# EAGLE design Slaves-Power-board (EAGLE 9.5.2)
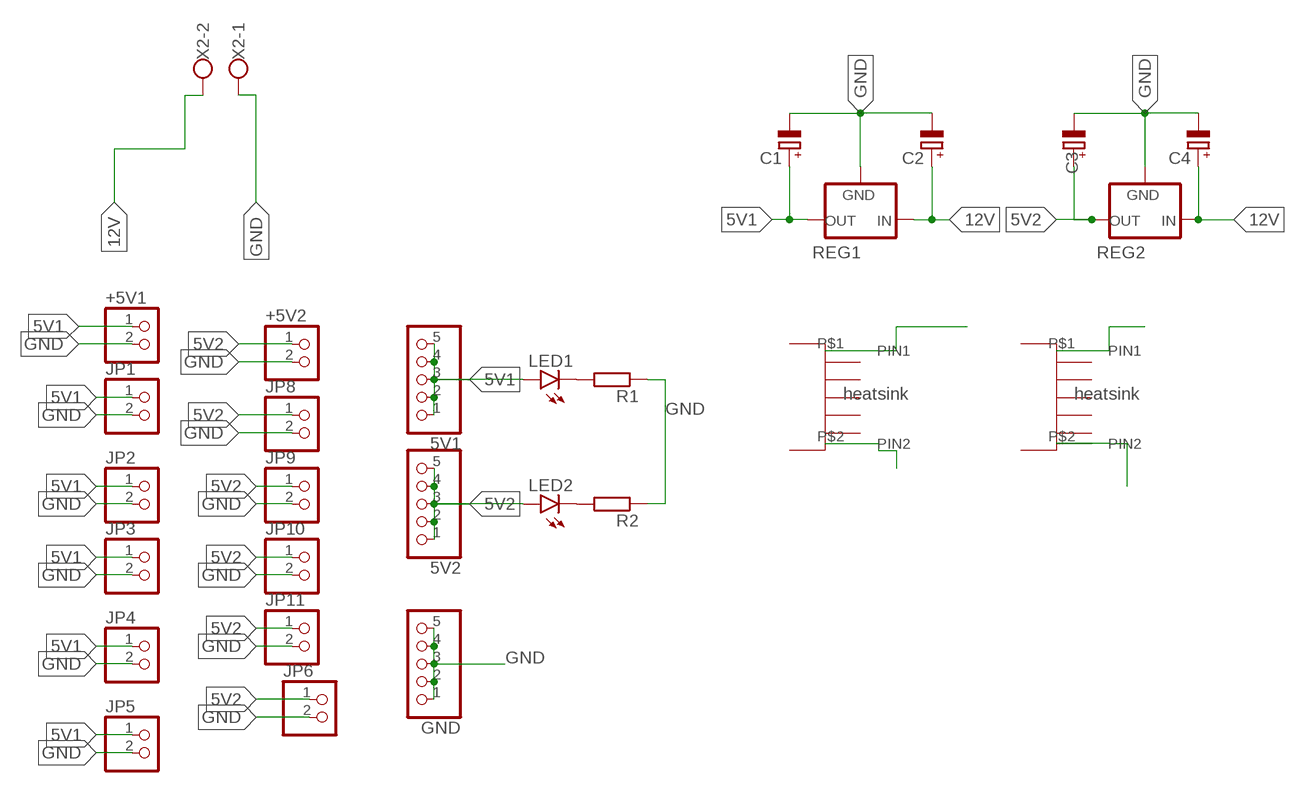
[diagram p0: schematic, sheet 1]

## Parts
5V1  PINHD-1X5  [1X05]
5V2  PINHD-1X5  [1X05]
+5V1  PINHD-2_DATA  [1X02_DATA]
+5V2  PINHD-2_DATA  [1X02_DATA]
C1  CAP_POL  [E3,5-8]
C2  CAP_POL  [E3,5-8]
C3  CAP_POL  [E3,5-8]
C4  CAP_POL  [E3,5-8]
GND  PINHD-1X5  [1X05]
JP1  PINHD-2_DATA  [1X02_DATA]
JP2  PINHD-2_DATA  [1X02_DATA]
JP3  PINHD-2_DATA  [1X02_DATA]
JP4  PINHD-2_DATA  [1X02_DATA]
JP5  PINHD-2_DATA  [1X02_DATA]
JP6  PINHD-2_DATA  [1X02_DATA]
JP8  PINHD-2_DATA  [1X02_DATA]
JP9  PINHD-2_DATA  [1X02_DATA]
JP10  PINHD-2_DATA  [1X02_DATA]
JP11  PINHD-2_DATA  [1X02_DATA]
LED1  LED5MM  [LED5MM]
LED2  LED5MM  [LED5MM]
R1  R-EU_0204/7  [0204/7]
R2  R-EU_0204/7  [0204/7]
REG1  78XXS  [78XXS]
REG2  78XXS  [78XXS]
U$1  HEAT-SINK  [HEAT_SINK]
U$2  HEAT-SINK  [HEAT_SINK]
X2  ROSTA.POWER  [W239-302]

## Nets
5V1: 5V1.1 5V1.2 5V1.3 5V1.4 5V1.5 +5V1.1 C1.+ JP1.1 JP2.1 JP3.1 JP4.1 JP5.1 LED1.A REG1.OUT
5V2: 5V2.1 5V2.2 5V2.3 5V2.4 5V2.5 +5V2.1 C3.+ JP6.1 JP8.1 JP9.1 JP10.1 JP11.1 LED2.A REG2.OUT
12V: C2.+ C4.+ REG1.IN REG2.IN X2.2
GND: +5V1.2 +5V2.2 C1.- C2.- C3.- C4.- GND.1 GND.2 GND.3 GND.4 GND.5 JP1.2 JP2.2 JP3.2 JP4.2 JP5.2 JP6.2 JP8.2 JP9.2 JP10.2 JP11.2 R1.1 R2.1 REG1.GND REG2.GND X2.1
N$1: LED1.K(C) R1.2
N$2: LED2.K(C) R2.2
N$3: U$1.P$2(PIN2)
N$4: U$1.P$1(PIN1)
N$5: U$2.P$1(PIN1)
N$6: U$2.P$2(PIN2)

## Library data of the parts
5V1 5V2 GND = MIA_LIBRARY-2-2-2:PINHD-1X5: PIN HEADER
+5V1 +5V2 JP1-JP6 JP8-JP11 = MIA_LIBRARY-2-2-2:PINHD-2_DATA: PIN HEADER
C1-C4 = MIA_LIBRARY-2-2-2:CAP_POL
LED1 LED2 = led:LED: LED OSRAM: - CHIPLED LG R971, LG N971, LY N971, LG Q971, LY Q971, LO R971, LY R971 LH N974, LH R974 LS Q976, LO Q976, LY Q976 LO Q996 - Hyper CHIPLED LW Q18S LB Q993, LB Q99A, LB R99A - SideLED LS A670, LO A670, LY A670, LG A670, LP A670 LB A673, LV A673, LT A673, LW A673 LH A674 LY A675 LS A676, LA A676, LO A676, LY A676, LW A676 LS A679, LY A679, LG A679 - Hyper Micro SIDELED® LS Y876, LA Y876, LO Y876, LY Y876 LT Y87S - SmartLED LW L88C, LW L88S LB L89C, LB L89S, LG L890 LS L89K, LO L89K, LY L89K LS L896, LA L896, LO L896, LY L896 - TOPLED LS T670, LO T670, LY T670, LG T670, LP T670 LSG T670, LSP T670, LSY T670, LOP T670, LYG T670 LG T671, LOG T671, LSG T671 LB T673, LV T673, LT T673, LW T673 LH T674 LS T676, LA T676, LO T676, LY T676, LB T676, LH T676, LSB T676, LW T676 LB T67C, LV T67C, LT T67C, LS T67K, LO T67K, LY T67K, LW E67C LS E67B, LA E67B, LO E67B, LY E67B, LB E67C, LV E67C, LT E67C LW T67C LS T679, LY T679, LG T679 LS T770, LO T770, LY T770, LG T770, LP T770 LB T773, LV T773, LT T773, LW T773 LH T774 LS E675, LA E675, LY E675, LS T675 LS T776, LA T776, LO T776, LY T776, LB T776 LHGB T686 LT T68C, LB T68C - Hyper Mini TOPLED® LB M676 - Mini TOPLED Santana® LG M470 LS M47K, LO M47K, LY M47K Source: http://www.osram.convergy.de LUXEON: - LUMILED® LXK2-PW12-R00, LXK2-PW12-S00, LXK2-PW14-U00, LXK2-PW14-V00 LXK2-PM12-R00, LXK2-PM12-S00, LXK2-PM14-U00 LXK2-PE12-Q00, LXK2-PE12-R00, LXK2-PE12-S00, LXK2-PE14-T00, LXK2-PE14-U00 LXK2-PB12-K00, LXK2-PB12-L00, LXK2-PB12-M00, LXK2-PB14-N00, LXK2-PB14-P00, LXK2-PB14-Q00 LXK2-PR12-L00, LXK2-PR12-M00, LXK2-PR14-Q00, LXK2-PR14-R00 LXK2-PD12-Q00, LXK2-PD12-R00, LXK2-PD12-S00 LXK2-PH12-R00, LXK2-PH12-S00 LXK2-PL12-P00, LXK2-PL12-Q00, LXK2-PL12-R00 Source: www.luxeon.com KINGBRIGHT: KA-3528ASYC Source: www.kingbright.com
R1 R2 = rcl:R-EU_: RESISTOR, European symbol; SPICEPREFIX: R
REG1 REG2 = MIA_LIBRARY-2-2-2:78XXS: VOLTAGE REGULATOR
U$1 U$2 = MIA_LIBRARY-2-2-2:HEAT-SINK
X2 = MIA_LIBRARY-2-2-2:ROSTA.POWER: WAGO SCREW CLAMP; OC_FARNELL: unknown; OC_NEWARK: unknown

## Board
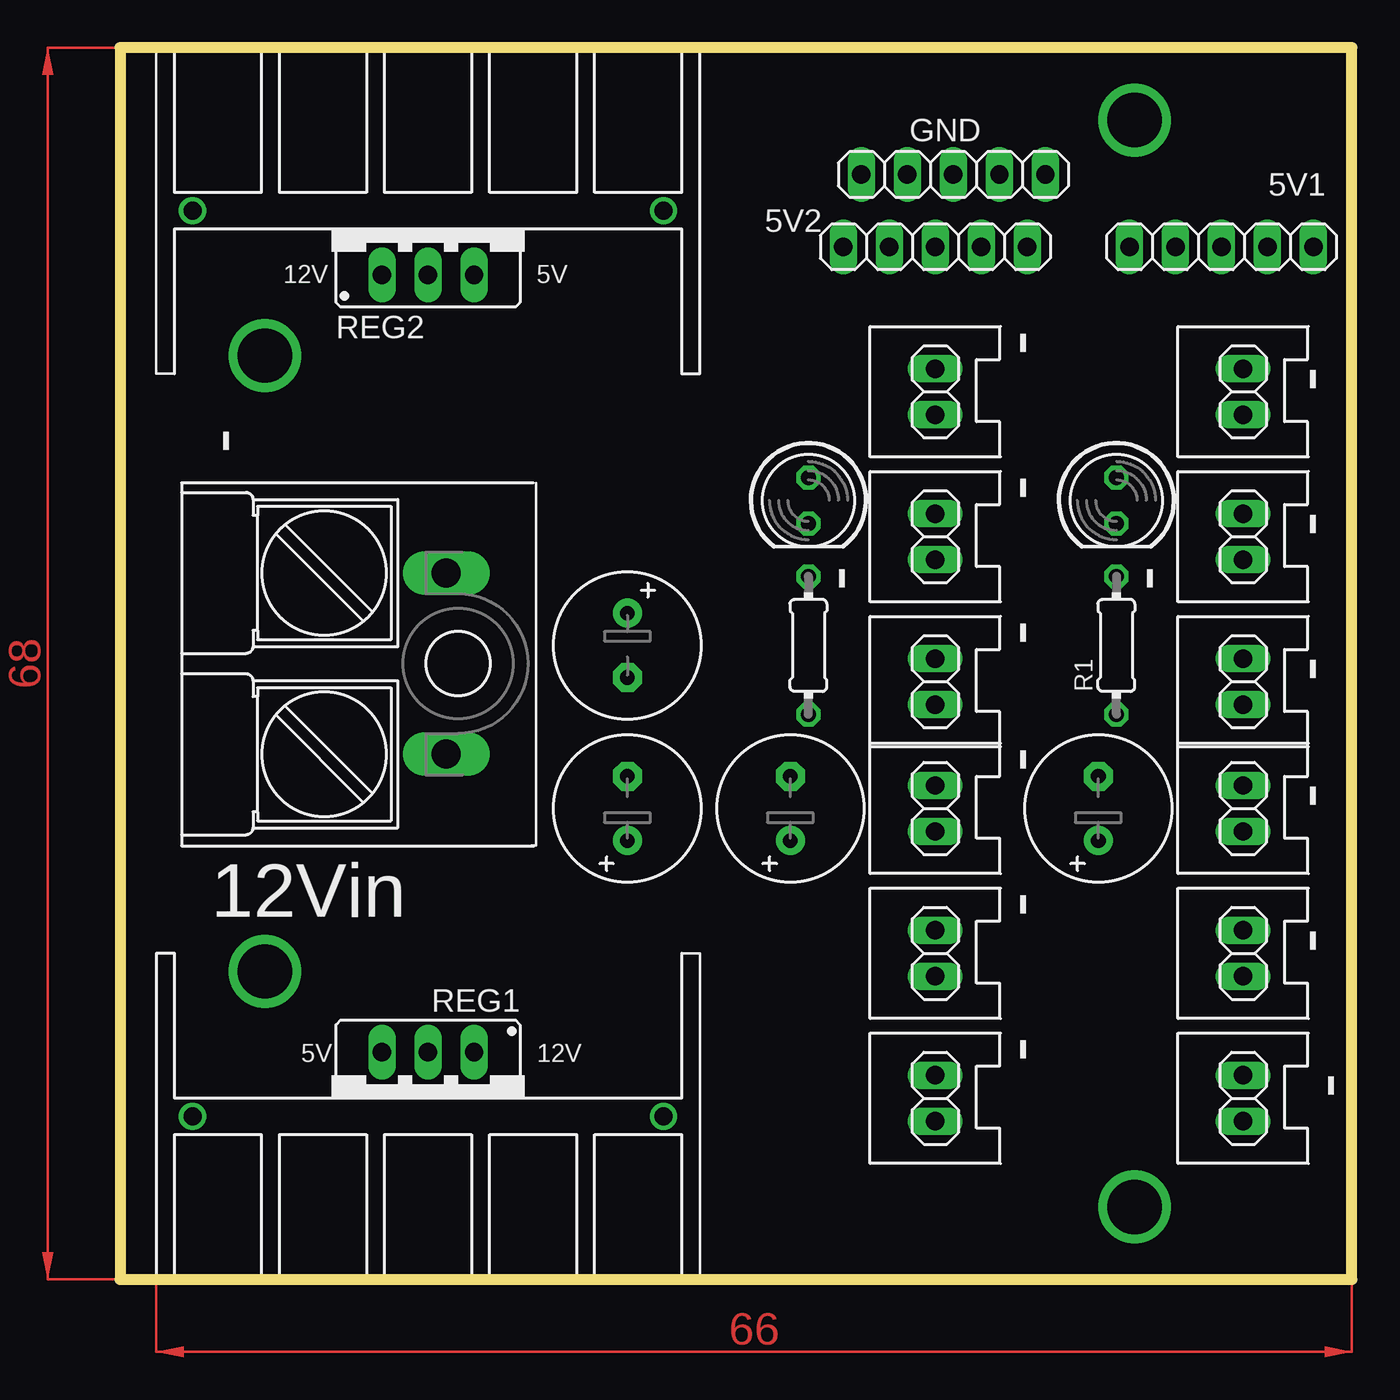
[diagram p1: board, top side]
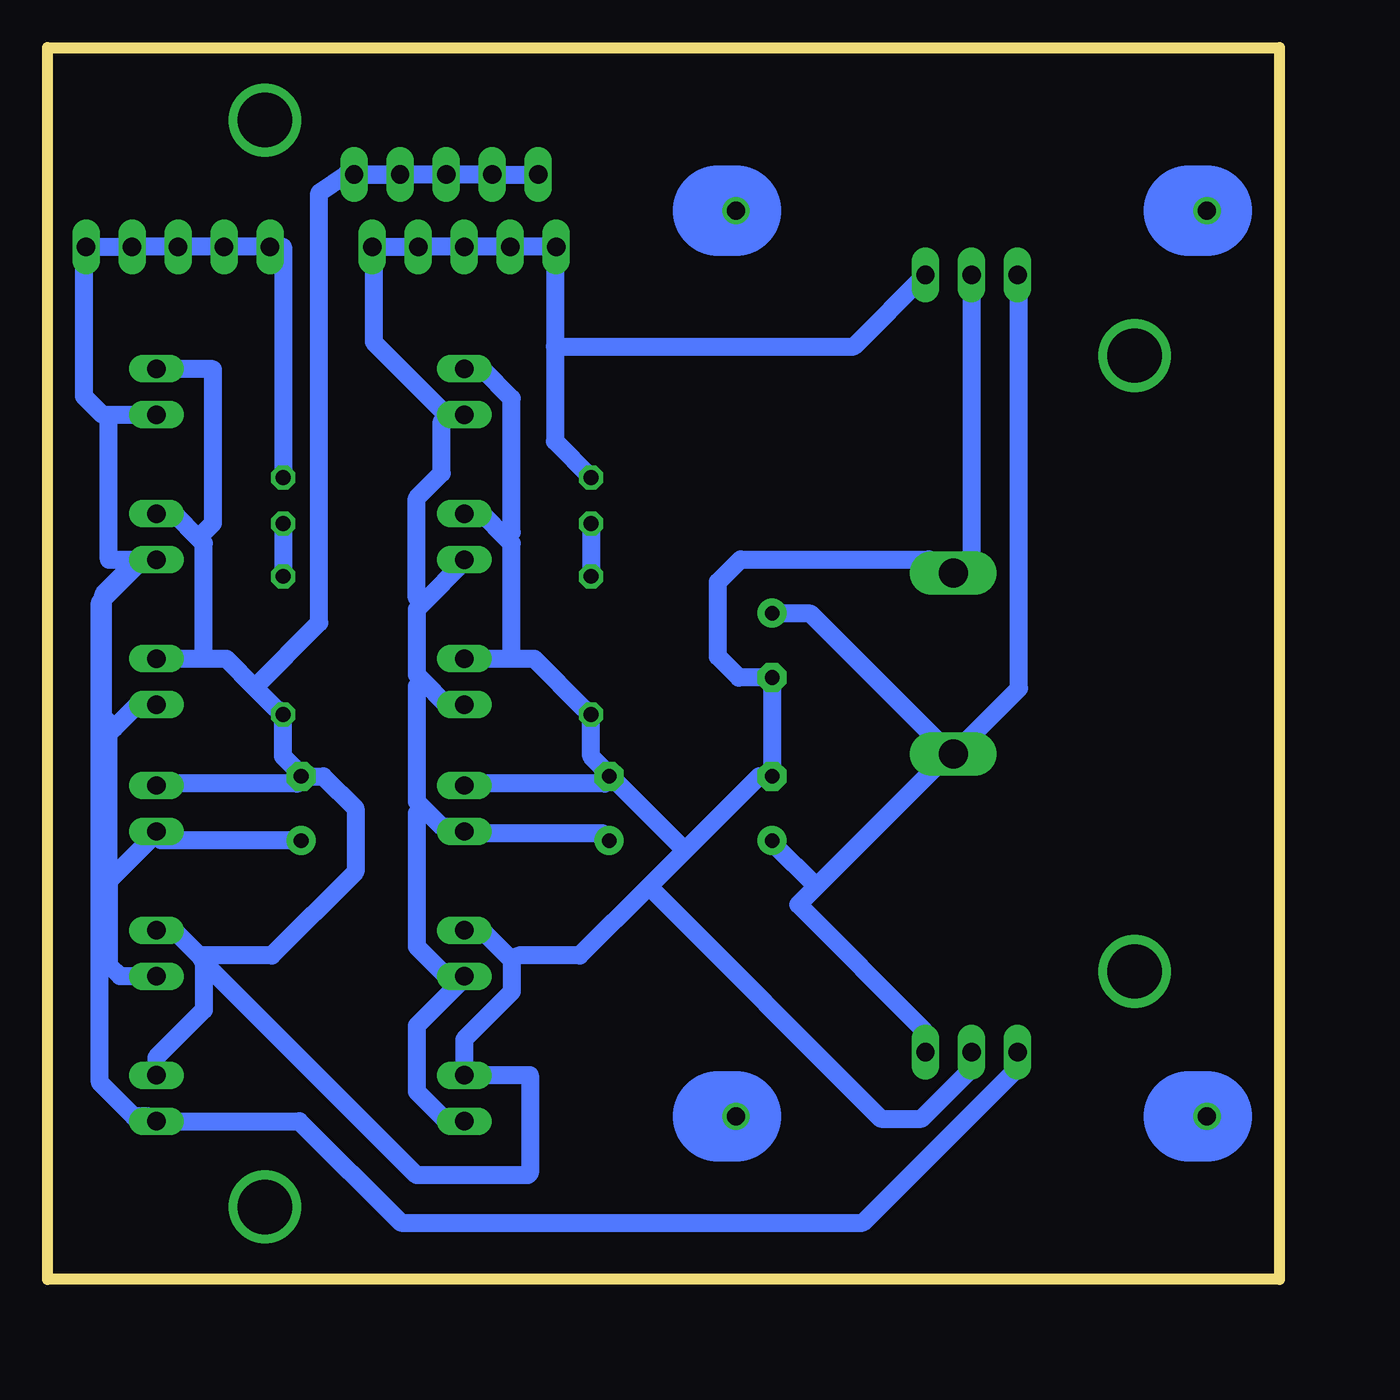
[diagram p2: board, bottom side, seen from below]

Size 68 x 68 mm. Coordinates in mm from the lower left corner, seen from the top.
Outline: 0,0 68,0 68,68 0,68 0,0
Copper layers (1*16): Top 0.035mm / dielectric 1.5mm / Bottom 0.035mm
Design rules "default *": minimum track width 1mm, minimum drill 1mm, track to track 0.6mm, track to pad 0.6mm, pad to pad 0.6mm, via to via 0.6mm, smd to smd 6mil, copper to edge 40mil, drill to drill 6mil, minimum pad ring 10mil, minimum via ring 8mil, stop-mask expansion 4mil, vias tented up to drill 0mil, thermal gap 10mil

### Footprints (pad centres in the part's own frame; a part is rotated, then mirrored left to right if it is on the bottom)
1X05 = drill 1.016 long: 1 -5.08,0; 2 -2.54,0; 3 0,0; 4 2.54,0; 5 5.08,0
1X02_DATA = drill 1.016 long: 1 -1.27,0; 2 1.27,0
E3,5-8 = drill 0.813 pad 1.6: + -1.778,0 | drill 0.813 pad 1.6 octagon: - 1.778,0
LED5MM = drill 0.813 octagon: A -1.27,0; K 1.27,0
0204/7 = drill 0.813 octagon: 1 -3.81,0; 2 3.81,0
78XXS = drill 1.016 long: GND 0,-2.54; IN -2.54,-2.54; OUT 2.54,-2.54
HEAT_SINK = drill 1: P$1 0,13; P$2 0,-13
W239-302 = drill 1.6 long: 1 -5,5; 2 5,5

### Placement (x,y rotation side)
5V1  60.8,57 0 top
5V2  45,57 0 top
+5V1  62,49 90 top
+5V2  45,49 90 top
C1  54,26 90 top
C2  28,26 90 top
C3  37,26 90 top
C4  28,35 270 top
GND  46,61 0 top
JP1  62,33 90 top
JP2  62,26 90 top
JP3  62,18 90 top
JP4  62,10 90 top
JP5  62,41 90 top
JP6  45,10 90 top
JP8  45,41 90 top
JP9  45,33 90 top
JP10  45,26 90 top
JP11  45,18 90 top
LED1  55,43 270 top
LED2  38,43 270 top
R1  55,35 90 top
R2  38,35 90 top
REG1  17,10 180 top
REG2  17,58 0 top
U$1  17,59 90 top
U$2  17,9 270 top
X2  13,34 270 top

### Tracks (layer width: path | path; a pad name or v marks a point on that pad's centre or on a via)
5V1
  Bottom 1: LED1.A 55,57 5V1.1 5V1.2 5V1.3 5V1.4 5V1.5 66,56.88 66,48.75 65,47.75 62,47.75 +5V1.1 64.47,47.73 64.62,47.68 64.62,39.73 JP5.1 63.02,39.73 64.92,37.83 64.92,31.05 64.31,30.44 | 64.31,22.31 62,24.62 JP2.1 61.75,24.25 54,24.25 C1.+ | 64.31,22.31 64.62,22 64.62,17.38 64,16.75 62,16.75 JP3.1 | 64.31,30.44 64.62,30.12 64.62,22.62 64.31,22.31 | JP1.1 63.02,31.73 64.31,30.44 | REG1.OUT 14.5,12.5 14.5,11.62 23,3.12 48.5,3.12 54.1,8.73 JP4.1 62.38,9 63.25,9 65.12,10.88 65.12,37.38 62.88,39.62
5V2
  Bottom 1: 40,51.5 40,57 5V2.1 5V2.2 5V2.3 5V2.4 5V2.5 50,57 50,51.75 46,47.75 45,47.75 +5V2.1 46.25,47.38 46.25,44.5 47.62,43.12 47.62,37.62 47.31,37.31 | 40,51.5 40,46.27 LED2.A | 40,51.5 23.5,51.5 REG2.OUT | JP6.1 45,8.75 46,8.75 47.62,10.38 47.62,14 45,16.62 JP11.1 45.75,16.5 47.62,18.38 47.62,25.75 47.31,26.06 | C3.+ 37,24.25 37.38,24.62 45,24.62 JP10.1 45.38,25 46.25,25 47.31,26.06 | 47.31,33.06 47.62,33.38 47.62,37 47.31,37.31 | 47.31,33.06 46,31.75 45,31.75 JP9.1 | 47.31,37.31 45,39.62 JP8.1 | 47.31,26.06 47.62,26.38 47.62,32.75 47.31,33.06
12V
  Bottom 1: 25.56,21.69 28,24.12 C2.+ | REG1.IN 19.62,12.62 19.62,13.75 26.56,20.69 25.56,21.69 | X2.2 14.38,32.62 14.38,55.38 REG2.IN | C4.+ 28,36.75 25.88,36.75 18.38,29.25 X2.2 | 25.56,21.69 18.5,28.75 X2.2
GND
  Bottom 1: GND.1 GND.2 GND.3 GND.4 | GND.4 GND.5 | JP4.2 62,12.25 59.38,14.88 59.38,17.62 | 59.38,17.62 61,19.25 62,19.25 JP3.2 | C1.- 54,27.88 55,28.88 R1.1 55.38,31.5 56.56,32.69 | JP2.2 62,27.38 54.25,27.38 C1.- | 59.38,34.25 58.12,34.25 56.56,32.69 | 59.38,34.25 62,34.25 JP1.2 | 59.69,40.94 59.38,40.62 59.38,34.25 | 59.69,40.94 61,42.25 62,42.25 JP5.2 | +5V1.2 62,50.25 58.88,50.25 58.88,41.75 59.69,40.94 | 59,17.88 55.62,17.88 51,22.5 51,26 52.78,27.78 C1.- | 59,17.88 59.62,17.88 59.38,17.5 47.62,5.75 41.5,5.75 41.38,5.88 41.38,11.27 JP6.2 45,13.25 42.38,15.88 42.38,17.62 | 59,17.88 59.38,17.62 | 56.56,32.69 53,36.25 53,59.99 51.54,61 GND.4 | REG2.GND 17,40 X2.1 19.38,39.75 29.75,39.75 31,38.5 31,34.38 29.85,33.22 C4.- C2.- 28.72,27.78 32.81,23.69 | 42.38,17.62 44,19.25 45,19.25 JP11.2 | C3.- 37,27.88 38,28.88 R2.1 38.38,31.5 41.12,34.25 42.38,34.25 | REG1.GND 17,11.62 19.75,8.88 22,8.88 34.81,21.69 | 32.81,23.69 36.62,27.5 C3.- | JP10.2 45,27.38 37.25,27.38 C3.- | 42.38,34.25 45,34.25 JP9.2 | 42.69,40.94 42.38,40.62 42.38,34.25 | 42.69,40.94 44,42.25 45,42.25 JP8.2 | +5V2.2 45,50.25 44,50.25 42.38,48.62 42.38,41.25 42.69,40.94 | 34.81,21.69 32.81,23.69 | 34.81,21.69 38.62,17.88 42,17.88 42.38,17.62
N$1
  Bottom 1: LED1.K R1.2
N$2
  Bottom 1: LED2.K R2.2
N$3
  Bottom 1.5: U$1.P$2 29,59
  Bottom 5: U$1.P$2 31,59
N$4
  Bottom 5: U$1.P$1 5,59
N$5
  Bottom 1.5: U$2.P$1 29,9
  Bottom 5: U$2.P$1 31,9
N$6
  Bottom 5: U$2.P$2 5,9
N$7  (via drill 3)
  other vias: 8,17
N$8  (via drill 3)
  other vias: 8,51
N$10  (via drill 3)
  other vias: 56,4
N$11  (via drill 3)
  other vias: 56,64
(copper drawn outside any net)
  shapes: Top area x2

### Text on the board
tNames: 12V | 5V | - | - | - | - | - | - | - | - | - | - | - | 12Vin | - | - | 5V | 12V | - | -